# EAGLE schematic schema wemosD1-chata (EAGLE 9.6.2)
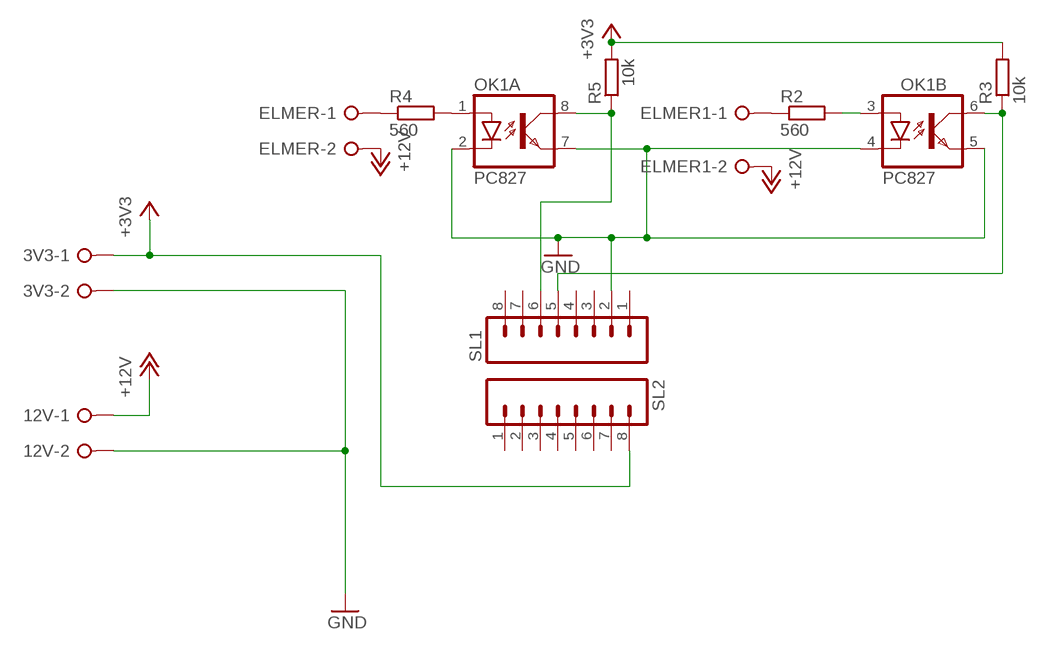
[diagram p0: schematic, sheet 1]

## Parts
3V3  W237-02P  [W237-132]
12V  W237-02P  [W237-132]
ELMER  W237-02P  [W237-132]
ELMER1  W237-02P  [W237-132]
OK1  PC827  [DIL08]
R2  560  R-EU_0204/7  [0204/7]
R3  10k  R-EU_0204/7  [0204/7]
R4  560  R-EU_0204/7  [0204/7]
R5  10k  R-EU_0204/7  [0204/7]
SL1  M08  [08P]
SL2  M08  [08P]

## Nets
+3V3: 3V3.1 R3.2 R5.2 SL2.8
+12V: 12V.1 ELMER1.2 ELMER.2
GND: 3V3.2 12V.2 OK1.2(A:C) OK1.4(B:C) OK1.5(B:EMIT) OK1.7(A:EMIT) SL1.2
N$1: OK1.1(A:A) R4.2
N$2: ELMER1.1 R2.1
N$4: OK1.3(B:A) R2.2
N$7: OK1.8(A:COL) R5.1 SL1.6
N$8: ELMER.1 R4.1
N$9: OK1.6(B:COL) R3.1 SL1.5
Unconnected: SL1.1 SL1.3 SL1.4 SL1.7 SL1.8 SL2.1 SL2.2 SL2.3 SL2.4 SL2.5 SL2.6 SL2.7

## Library data of the parts
3V3 12V ELMER ELMER1 = con-wago-508:W237-02P: WAGO SREW CLAMP; OC_FARNELL: unknown; OC_NEWARK: unknown
OK1 = optocoupler:PC827: SHARP OPTO COUPLER; OC_FARNELL: unknown; OC_NEWARK: unknown
R2-R5 = rcl:R-EU_: RESISTOR, European symbol
SL1 SL2 = con-amp-quick:M08: AMP QUICK CONNECTOR; OC_FARNELL: unknown; OC_NEWARK: unknown